# Altium schematic sheet MIC5248.SchDoc
size A
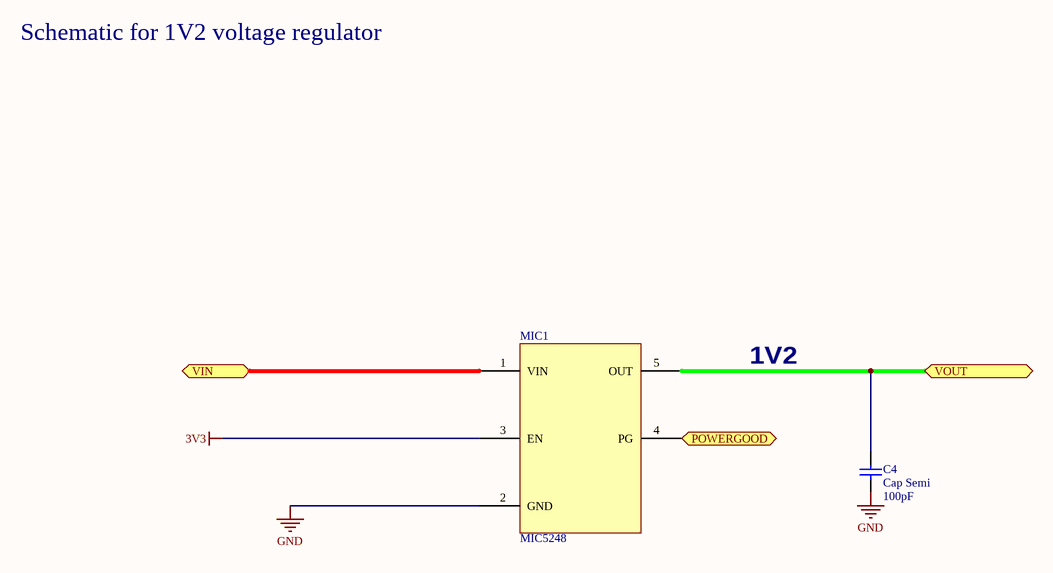
[diagram p0: MIC5248.SchDoc]

## Parts
C4  Cap Semi  value 100pF  [C1206]
MIC1  MIC5248  [SOT95P280X145-5N]

## Ports
POWERGOOD, VIN, VOUT

## Nets
3V3: MIC1.3(EN)
GND: C4.1 MIC1.2(GND)
POWERGOOD: MIC1.4(PG) ; port POWERGOOD
VIN: MIC1.1(VIN) ; port VIN
VOUT: C4.2 MIC1.5(OUT) ; port VOUT

## Notes on the sheet
- Schematic for 1V2 voltage regulator
- 1V2

## Library data of the parts
C4 = Cap Semi: Capacitor (Semiconductor SIM Model); Published: 8-Jun-2000; LatestRevisionDate: 29-May-2009; LatestRevisionNote: IPC-7351 Footprint Added.; PackageReference: C1206; Publisher: Altium Limited; PackageDescription: Chip Capacitor